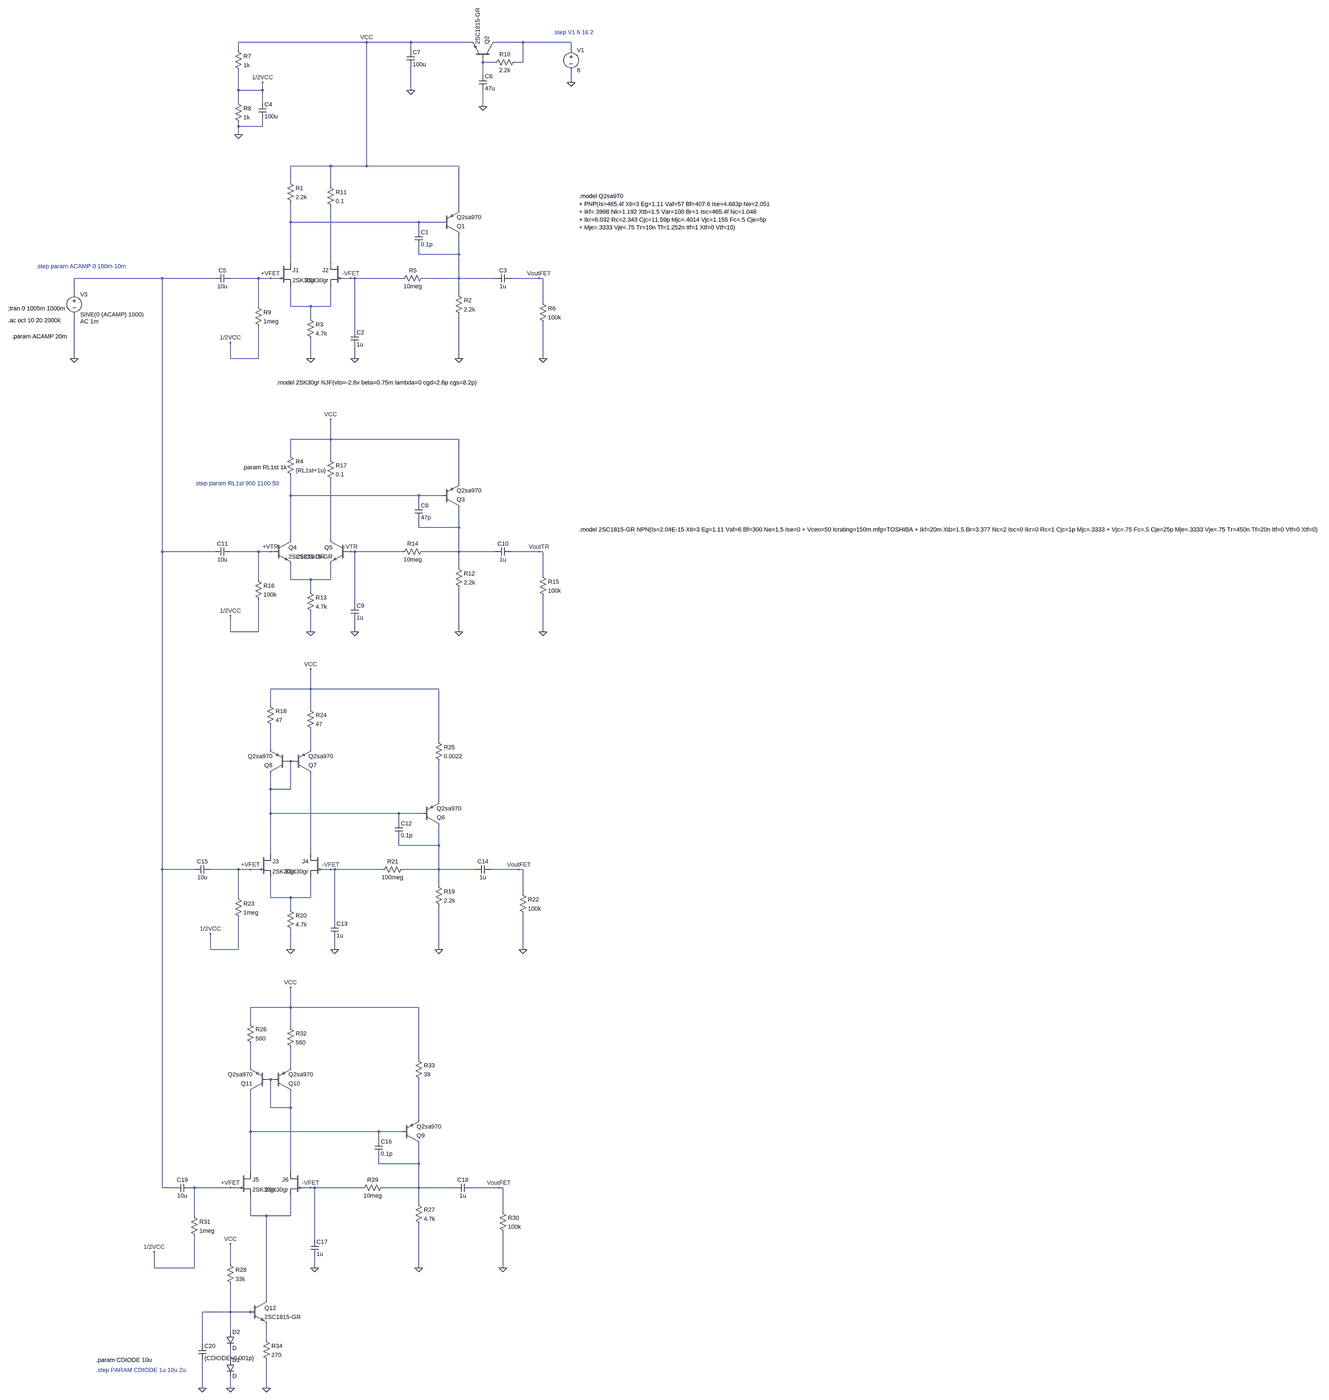
[diagram p0: schematic Discrete_OP 3stage.asc, whole sheet]
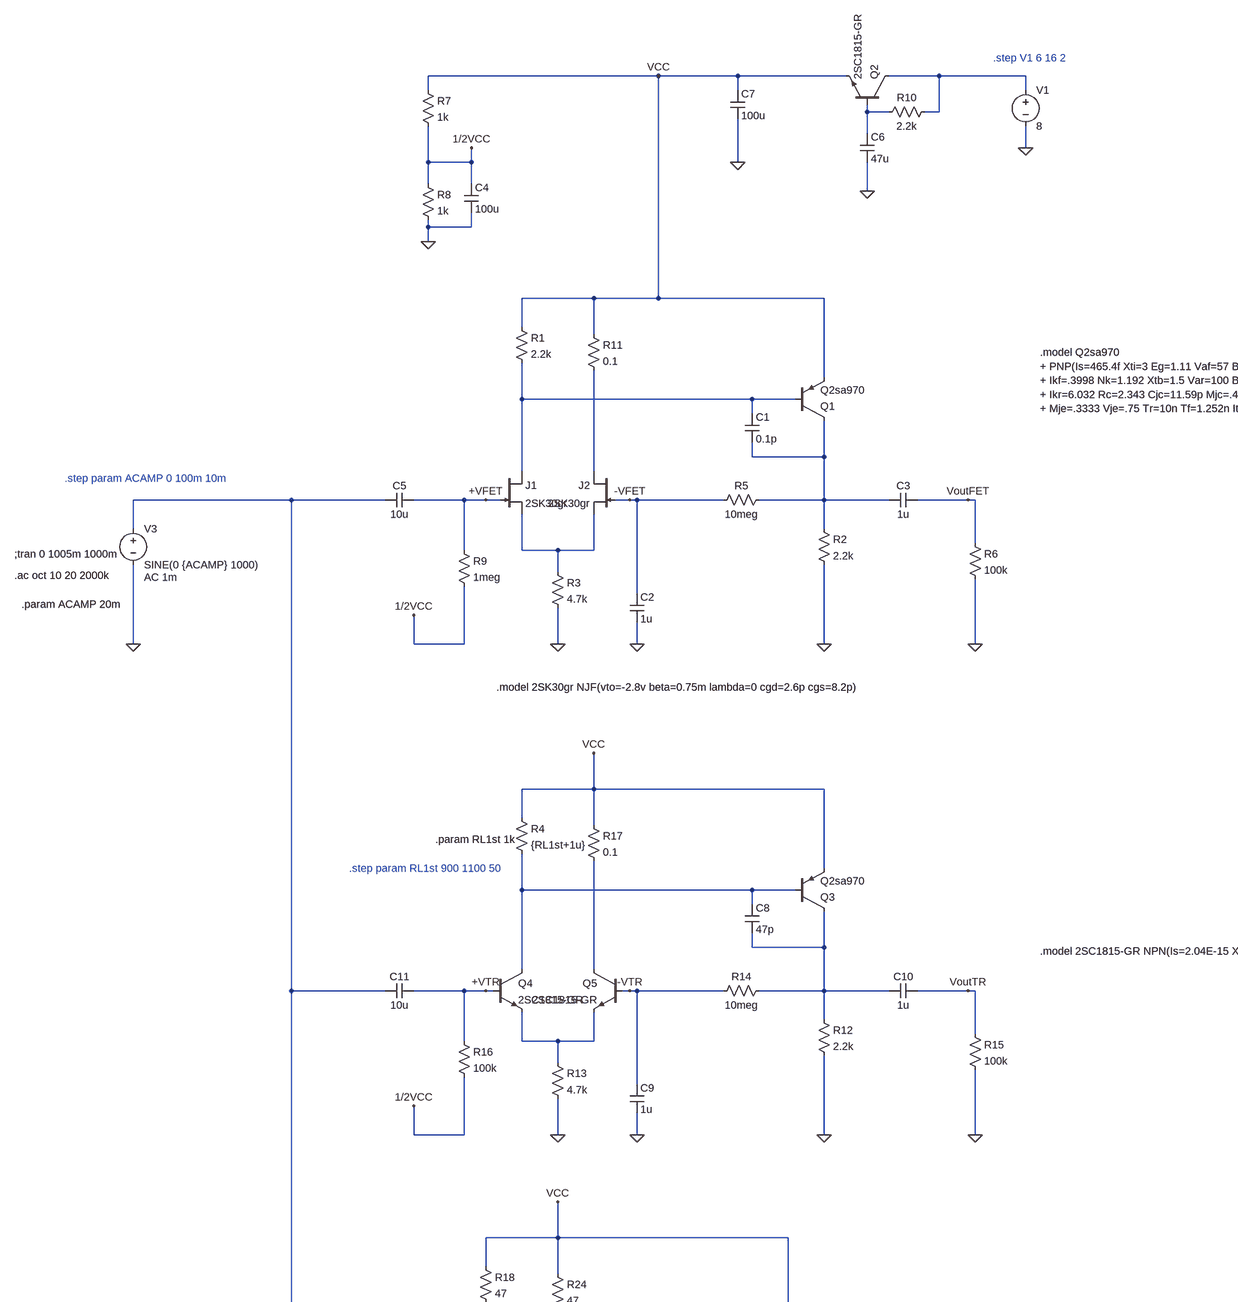
[diagram p1: schematic Discrete_OP 3stage.asc, part, row 1 of 2, column 1 of 2]
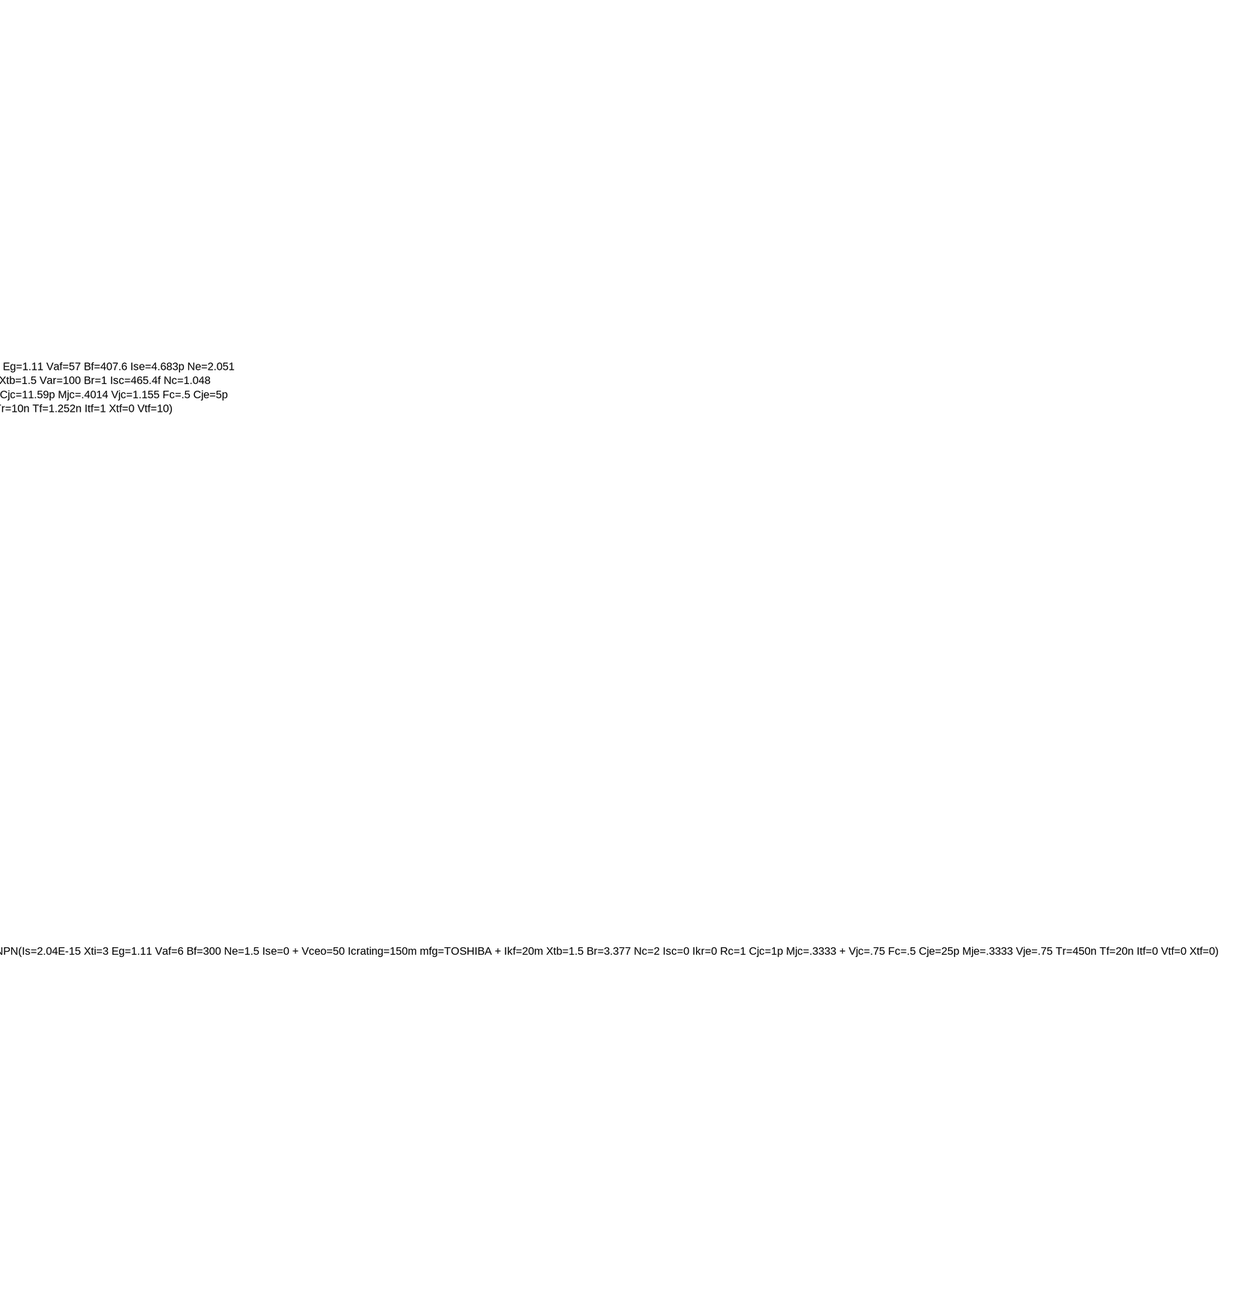
[diagram p2: schematic Discrete_OP 3stage.asc, part, row 1 of 2, column 2 of 2]
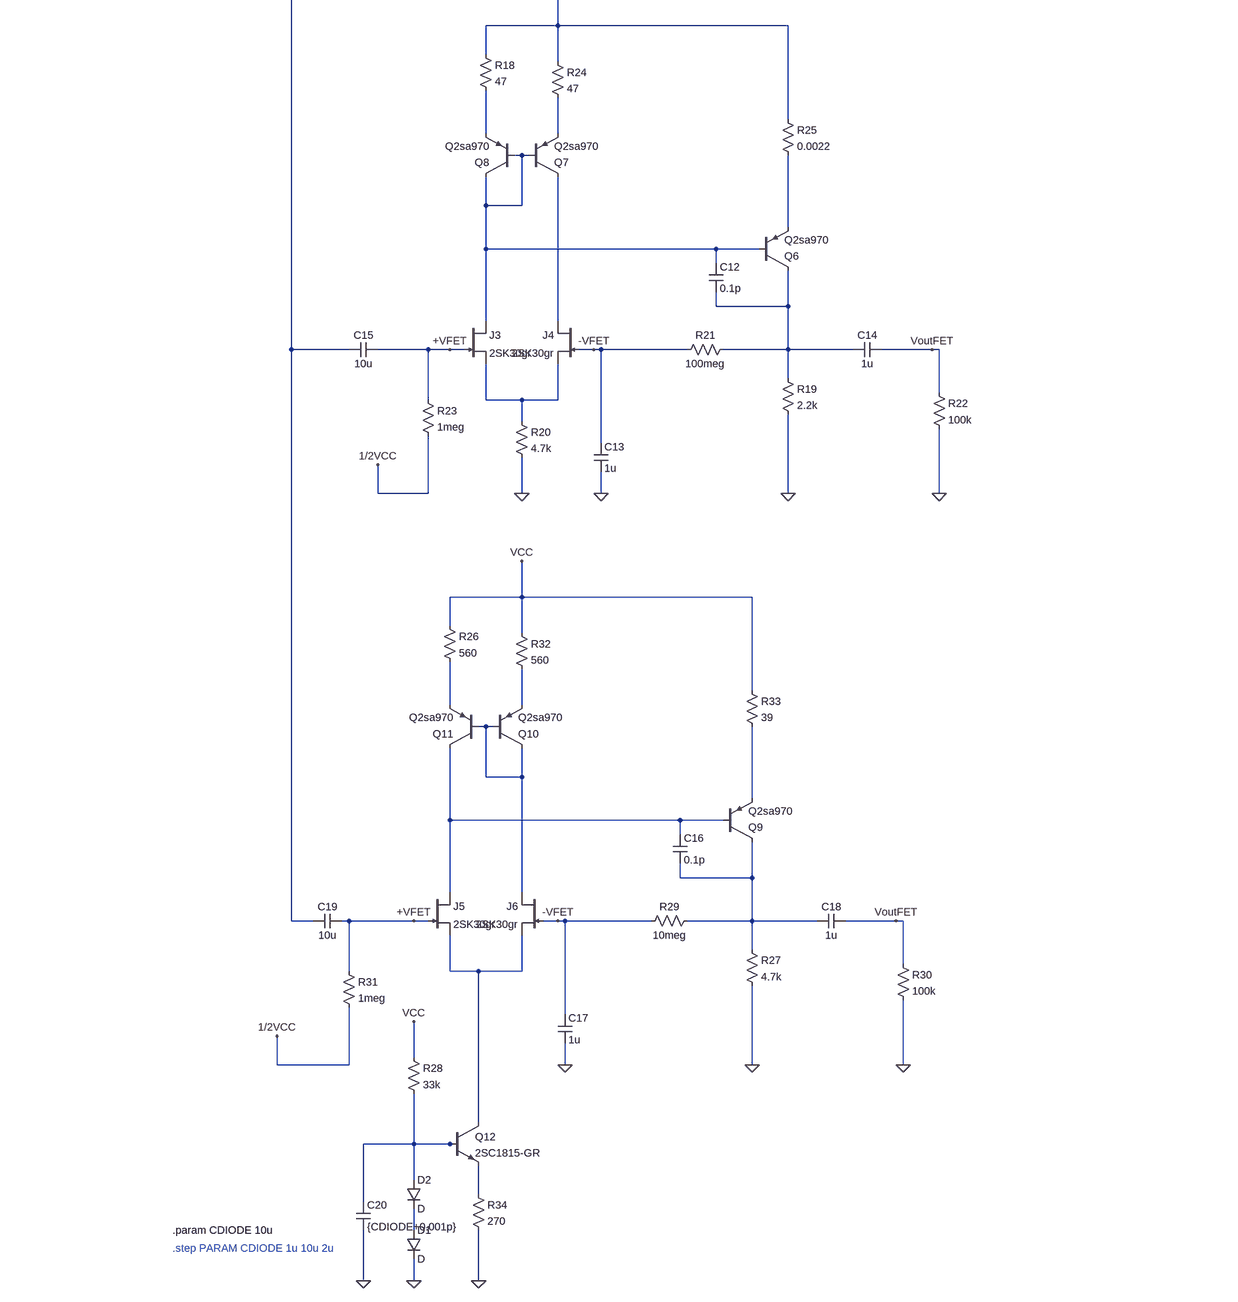
[diagram p3: schematic Discrete_OP 3stage.asc, part, row 2 of 2, column 1 of 2]
Discrete_OP 3stage.asc, the LTspice schematic file:
Version 4
SHEET 1 4864 4708
WIRE 608 -1136 96 -1136
WIRE 784 -1136 608 -1136
WIRE 1024 -1136 784 -1136
WIRE 1232 -1136 1120 -1136
WIRE 1424 -1136 1232 -1136
WIRE 96 -1104 96 -1136
WIRE 784 -1104 784 -1136
WIRE 1424 -1104 1424 -1136
WIRE 1072 -1056 1072 -1072
WIRE 1120 -1056 1072 -1056
WIRE 1232 -1056 1232 -1136
WIRE 1232 -1056 1200 -1056
WIRE 1072 -1008 1072 -1056
WIRE 1424 -976 1424 -1024
WIRE 96 -944 96 -1024
WIRE 192 -944 192 -976
WIRE 192 -944 96 -944
WIRE 784 -944 784 -1040
WIRE 96 -896 96 -944
WIRE 192 -896 192 -944
WIRE 1072 -880 1072 -944
WIRE 96 -800 96 -816
WIRE 192 -800 192 -832
WIRE 192 -800 96 -800
WIRE 96 -768 96 -800
WIRE 464 -560 304 -560
WIRE 608 -560 608 -1136
WIRE 608 -560 464 -560
WIRE 976 -560 608 -560
WIRE 304 -496 304 -560
WIRE 464 -480 464 -560
WIRE 976 -384 976 -560
WIRE 304 -336 304 -416
WIRE 816 -336 304 -336
WIRE 912 -336 816 -336
WIRE 816 -304 816 -336
WIRE 816 -208 816 -240
WIRE 976 -208 976 -288
WIRE 976 -208 816 -208
WIRE 304 -176 304 -336
WIRE 464 -176 464 -400
WIRE -208 -112 -560 -112
WIRE 0 -112 -208 -112
WIRE 176 -112 64 -112
WIRE 224 -112 176 -112
WIRE 256 -112 224 -112
WIRE 544 -112 512 -112
WIRE 560 -112 544 -112
WIRE 752 -112 560 -112
WIRE 976 -112 976 -208
WIRE 976 -112 832 -112
WIRE 1120 -112 976 -112
WIRE 1296 -112 1184 -112
WIRE 1312 -112 1296 -112
WIRE -560 -48 -560 -112
WIRE 976 -48 976 -112
WIRE 1312 -16 1312 -112
WIRE 176 0 176 -112
WIRE 304 0 304 -80
WIRE 384 0 304 0
WIRE 464 0 464 -80
WIRE 464 0 384 0
WIRE 384 48 384 0
WIRE 560 96 560 -112
WIRE -560 208 -560 32
WIRE 64 208 64 144
WIRE 176 208 176 80
WIRE 176 208 64 208
WIRE 384 208 384 128
WIRE 560 208 560 160
WIRE 976 208 976 32
WIRE 1312 208 1312 64
WIRE 464 544 464 464
WIRE 464 544 304 544
WIRE 976 544 464 544
WIRE 304 608 304 544
WIRE 464 624 464 544
WIRE 976 720 976 544
WIRE 304 768 304 688
WIRE 816 768 304 768
WIRE 912 768 816 768
WIRE 816 800 816 768
WIRE 816 896 816 864
WIRE 976 896 976 816
WIRE 976 896 816 896
WIRE 304 944 304 768
WIRE 464 944 464 704
WIRE -208 992 -208 -112
WIRE 0 992 -208 992
WIRE 176 992 64 992
WIRE 224 992 176 992
WIRE 240 992 224 992
WIRE 544 992 528 992
WIRE 560 992 544 992
WIRE 752 992 560 992
WIRE 976 992 976 896
WIRE 976 992 832 992
WIRE 1120 992 976 992
WIRE 1296 992 1184 992
WIRE 1312 992 1296 992
WIRE 976 1056 976 992
WIRE 1312 1088 1312 992
WIRE 176 1104 176 992
WIRE 304 1104 304 1040
WIRE 384 1104 304 1104
WIRE 464 1104 464 1040
WIRE 464 1104 384 1104
WIRE 384 1152 384 1104
WIRE 560 1200 560 992
WIRE 64 1312 64 1248
WIRE 176 1312 176 1184
WIRE 176 1312 64 1312
WIRE 384 1312 384 1232
WIRE 560 1312 560 1264
WIRE 976 1312 976 1136
WIRE 1312 1312 1312 1168
WIRE 384 1696 384 1616
WIRE 384 1696 224 1696
WIRE 896 1696 384 1696
WIRE 224 1760 224 1696
WIRE 384 1776 384 1696
WIRE 896 1904 896 1696
WIRE 224 1936 224 1840
WIRE 384 1936 384 1856
WIRE 304 1984 288 1984
WIRE 320 1984 304 1984
WIRE 224 2096 224 2032
WIRE 304 2096 304 1984
WIRE 304 2096 224 2096
WIRE 896 2144 896 1984
WIRE 224 2192 224 2096
WIRE 736 2192 224 2192
WIRE 832 2192 736 2192
WIRE 736 2224 736 2192
WIRE 736 2320 736 2288
WIRE 896 2320 896 2240
WIRE 896 2320 736 2320
WIRE 224 2352 224 2192
WIRE 384 2352 384 2032
WIRE -208 2416 -208 992
WIRE -80 2416 -208 2416
WIRE 96 2416 -16 2416
WIRE 144 2416 96 2416
WIRE 176 2416 144 2416
WIRE 464 2416 432 2416
WIRE 480 2416 464 2416
WIRE 672 2416 480 2416
WIRE 896 2416 896 2320
WIRE 896 2416 752 2416
WIRE 1040 2416 896 2416
WIRE 1216 2416 1104 2416
WIRE 1232 2416 1216 2416
WIRE 896 2480 896 2416
WIRE 1232 2512 1232 2416
WIRE 96 2528 96 2416
WIRE 224 2528 224 2448
WIRE 304 2528 224 2528
WIRE 384 2528 384 2448
WIRE 384 2528 304 2528
WIRE 304 2576 304 2528
WIRE 480 2624 480 2416
WIRE -16 2736 -16 2672
WIRE 96 2736 96 2608
WIRE 96 2736 -16 2736
WIRE 304 2736 304 2656
WIRE 480 2736 480 2688
WIRE 896 2736 896 2560
WIRE 1232 2736 1232 2592
WIRE 304 3168 304 3088
WIRE 304 3168 144 3168
WIRE 816 3168 304 3168
WIRE 144 3232 144 3168
WIRE 304 3248 304 3168
WIRE 816 3376 816 3168
WIRE 144 3408 144 3312
WIRE 304 3408 304 3328
WIRE 224 3456 208 3456
WIRE 240 3456 224 3456
WIRE 224 3568 224 3456
WIRE 304 3568 304 3504
WIRE 304 3568 224 3568
WIRE 816 3616 816 3456
WIRE 144 3664 144 3504
WIRE 656 3664 144 3664
WIRE 752 3664 656 3664
WIRE 656 3696 656 3664
WIRE 656 3792 656 3760
WIRE 816 3792 816 3712
WIRE 816 3792 656 3792
WIRE 144 3824 144 3664
WIRE 304 3824 304 3568
WIRE -208 3888 -208 2416
WIRE -160 3888 -208 3888
WIRE -80 3888 -96 3888
WIRE 64 3888 -80 3888
WIRE 96 3888 64 3888
WIRE 384 3888 352 3888
WIRE 400 3888 384 3888
WIRE 592 3888 400 3888
WIRE 816 3888 816 3792
WIRE 816 3888 672 3888
WIRE 960 3888 816 3888
WIRE 1136 3888 1024 3888
WIRE 1152 3888 1136 3888
WIRE 816 3952 816 3888
WIRE 1152 3984 1152 3888
WIRE -80 4000 -80 3888
WIRE 144 4000 144 3920
WIRE 208 4000 144 4000
WIRE 304 4000 304 3920
WIRE 304 4000 208 4000
WIRE 400 4096 400 3888
WIRE 64 4192 64 4112
WIRE -240 4208 -240 4144
WIRE -80 4208 -80 4080
WIRE -80 4208 -240 4208
WIRE 400 4208 400 4160
WIRE 816 4208 816 4032
WIRE 1152 4208 1152 4064
WIRE 208 4336 208 4000
WIRE 64 4384 64 4272
WIRE 64 4384 -48 4384
WIRE 144 4384 64 4384
WIRE 160 4384 144 4384
WIRE 64 4464 64 4384
WIRE 208 4496 208 4432
WIRE -48 4512 -48 4384
WIRE 64 4576 64 4528
WIRE -48 4688 -48 4576
WIRE 64 4688 64 4640
WIRE 208 4688 208 4576
FLAG -560 208 0
FLAG 384 208 0
FLAG 976 208 0
FLAG 1312 208 0
FLAG 1424 -976 0
FLAG 560 208 0
FLAG 1296 -112 VoutFET
FLAG 224 -112 +VFET
FLAG 544 -112 -VFET
FLAG 608 -1136 VCC
FLAG 96 -768 0
FLAG 192 -976 1/2VCC
FLAG 64 144 1/2VCC
FLAG 1072 -880 0
FLAG 784 -944 0
FLAG 384 1312 0
FLAG 976 1312 0
FLAG 1312 1312 0
FLAG 560 1312 0
FLAG 1296 992 VoutTR
FLAG 224 992 +VTR
FLAG 544 992 -VTR
FLAG 64 1248 1/2VCC
FLAG 464 464 VCC
FLAG 304 2736 0
FLAG 896 2736 0
FLAG 1232 2736 0
FLAG 480 2736 0
FLAG 1216 2416 VoutFET
FLAG 144 2416 +VFET
FLAG 464 2416 -VFET
FLAG -16 2672 1/2VCC
FLAG 384 1616 VCC
FLAG 208 4688 0
FLAG 816 4208 0
FLAG 1152 4208 0
FLAG 400 4208 0
FLAG 1136 3888 VoutFET
FLAG 64 3888 +VFET
FLAG 384 3888 -VFET
FLAG -240 4144 1/2VCC
FLAG 304 3088 VCC
FLAG 64 4688 0
FLAG 64 4112 VCC
FLAG -48 4688 0
SYMBOL njf 256 -176 R0
SYMATTR InstName J1
SYMATTR Value 2SK30gr
SYMBOL njf 512 -176 M0
SYMATTR InstName J2
SYMATTR Value 2SK30gr
SYMBOL pnp 912 -288 M180
SYMATTR InstName Q1
SYMATTR Value Q2sa970
SYMBOL res 288 -512 R0
SYMATTR InstName R1
SYMATTR Value 2.2k
SYMBOL res 960 -64 R0
SYMATTR InstName R2
SYMATTR Value 2.2k
SYMBOL cap 800 -304 R0
SYMATTR InstName C1
SYMATTR Value 0.1p
SYMBOL res 368 32 R0
SYMATTR InstName R3
SYMATTR Value 4.7k
SYMBOL voltage 1424 -1120 R0
WINDOW 123 0 0 Left 2
WINDOW 39 0 0 Left 2
SYMATTR InstName V1
SYMATTR Value 8
SYMBOL cap 544 96 R0
SYMATTR InstName C2
SYMATTR Value 1u
SYMBOL res 848 -128 R90
WINDOW 0 0 56 VBottom 2
WINDOW 3 32 56 VTop 2
SYMATTR InstName R5
SYMATTR Value 10meg
SYMBOL voltage -560 -64 R0
WINDOW 123 24 124 Left 2
WINDOW 39 0 0 Left 2
SYMATTR Value2 AC 1m
SYMATTR InstName V3
SYMATTR Value SINE(0 {ACAMP} 1000)
SYMBOL res 1296 -32 R0
SYMATTR InstName R6
SYMATTR Value 100k
SYMBOL cap 1184 -128 R90
WINDOW 0 0 32 VBottom 2
WINDOW 3 32 32 VTop 2
SYMATTR InstName C3
SYMATTR Value 1u
SYMBOL res 80 -1120 R0
SYMATTR InstName R7
SYMATTR Value 1k
SYMBOL res 80 -912 R0
SYMATTR InstName R8
SYMATTR Value 1k
SYMBOL cap 176 -896 R0
SYMATTR InstName C4
SYMATTR Value 100u
SYMBOL res 160 -16 R0
SYMATTR InstName R9
SYMATTR Value 1meg
SYMBOL cap 64 -128 R90
WINDOW 0 0 32 VBottom 2
WINDOW 3 32 32 VTop 2
SYMATTR InstName C5
SYMATTR Value 10u
SYMBOL npn 1120 -1072 M270
SYMATTR InstName Q2
SYMATTR Value 2SC1815-GR
SYMBOL res 1216 -1072 R90
WINDOW 0 0 56 VBottom 2
WINDOW 3 32 56 VTop 2
SYMATTR InstName R10
SYMATTR Value 2.2k
SYMBOL cap 1056 -1008 R0
SYMATTR InstName C6
SYMATTR Value 47u
SYMBOL cap 768 -1104 R0
SYMATTR InstName C7
SYMATTR Value 100u
SYMBOL res 448 -496 R0
SYMATTR InstName R11
SYMATTR Value 0.1
SYMBOL pnp 912 816 M180
SYMATTR InstName Q3
SYMATTR Value Q2sa970
SYMBOL res 288 592 R0
SYMATTR InstName R4
SYMATTR Value {RL1st+1u}
SYMBOL res 960 1040 R0
SYMATTR InstName R12
SYMATTR Value 2.2k
SYMBOL cap 800 800 R0
SYMATTR InstName C8
SYMATTR Value 47p
SYMBOL res 368 1136 R0
SYMATTR InstName R13
SYMATTR Value 4.7k
SYMBOL cap 544 1200 R0
SYMATTR InstName C9
SYMATTR Value 1u
SYMBOL res 848 976 R90
WINDOW 0 0 56 VBottom 2
WINDOW 3 32 56 VTop 2
SYMATTR InstName R14
SYMATTR Value 10meg
SYMBOL res 1296 1072 R0
SYMATTR InstName R15
SYMATTR Value 100k
SYMBOL cap 1184 976 R90
WINDOW 0 0 32 VBottom 2
WINDOW 3 32 32 VTop 2
SYMATTR InstName C10
SYMATTR Value 1u
SYMBOL res 160 1088 R0
SYMATTR InstName R16
SYMATTR Value 100k
SYMBOL cap 64 976 R90
WINDOW 0 0 32 VBottom 2
WINDOW 3 32 32 VTop 2
SYMATTR InstName C11
SYMATTR Value 10u
SYMBOL res 448 608 R0
SYMATTR InstName R17
SYMATTR Value 0.1
SYMBOL npn 240 944 R0
SYMATTR InstName Q4
SYMATTR Value 2SC1815-GR
SYMBOL npn 528 944 M0
SYMATTR InstName Q5
SYMATTR Value 2SC1815-GR
SYMBOL njf 176 2352 R0
SYMATTR InstName J3
SYMATTR Value 2SK30gr
SYMBOL njf 432 2352 M0
SYMATTR InstName J4
SYMATTR Value 2SK30gr
SYMBOL pnp 832 2240 M180
SYMATTR InstName Q6
SYMATTR Value Q2sa970
SYMBOL res 208 1744 R0
SYMATTR InstName R18
SYMATTR Value 47
SYMBOL res 880 2464 R0
SYMATTR InstName R19
SYMATTR Value 2.2k
SYMBOL cap 720 2224 R0
SYMATTR InstName C12
SYMATTR Value 0.1p
SYMBOL res 288 2560 R0
SYMATTR InstName R20
SYMATTR Value 4.7k
SYMBOL cap 464 2624 R0
SYMATTR InstName C13
SYMATTR Value 1u
SYMBOL res 768 2400 R90
WINDOW 0 0 56 VBottom 2
WINDOW 3 32 56 VTop 2
SYMATTR InstName R21
SYMATTR Value 100meg
SYMBOL res 1216 2496 R0
SYMATTR InstName R22
SYMATTR Value 100k
SYMBOL cap 1104 2400 R90
WINDOW 0 0 32 VBottom 2
WINDOW 3 32 32 VTop 2
SYMATTR InstName C14
SYMATTR Value 1u
SYMBOL res 80 2512 R0
SYMATTR InstName R23
SYMATTR Value 1meg
SYMBOL cap -16 2400 R90
WINDOW 0 0 32 VBottom 2
WINDOW 3 32 32 VTop 2
SYMATTR InstName C15
SYMATTR Value 10u
SYMBOL res 368 1760 R0
SYMATTR InstName R24
SYMATTR Value 47
SYMBOL pnp 320 2032 M180
SYMATTR InstName Q7
SYMATTR Value Q2sa970
SYMBOL pnp 288 2032 R180
SYMATTR InstName Q8
SYMATTR Value Q2sa970
SYMBOL res 880 1888 R0
SYMATTR InstName R25
SYMATTR Value 0.0022
SYMBOL njf 96 3824 R0
SYMATTR InstName J5
SYMATTR Value 2SK30gr
SYMBOL njf 352 3824 M0
SYMATTR InstName J6
SYMATTR Value 2SK30gr
SYMBOL pnp 752 3712 M180
SYMATTR InstName Q9
SYMATTR Value Q2sa970
SYMBOL res 128 3216 R0
SYMATTR InstName R26
SYMATTR Value 560
SYMBOL res 800 3936 R0
SYMATTR InstName R27
SYMATTR Value 4.7k
SYMBOL cap 640 3696 R0
SYMATTR InstName C16
SYMATTR Value 0.1p
SYMBOL cap 384 4096 R0
SYMATTR InstName C17
SYMATTR Value 1u
SYMBOL res 688 3872 R90
WINDOW 0 0 56 VBottom 2
WINDOW 3 32 56 VTop 2
SYMATTR InstName R29
SYMATTR Value 10meg
SYMBOL res 1136 3968 R0
SYMATTR InstName R30
SYMATTR Value 100k
SYMBOL cap 1024 3872 R90
WINDOW 0 0 32 VBottom 2
WINDOW 3 32 32 VTop 2
SYMATTR InstName C18
SYMATTR Value 1u
SYMBOL res -96 3984 R0
SYMATTR InstName R31
SYMATTR Value 1meg
SYMBOL cap -96 3872 R90
WINDOW 0 0 32 VBottom 2
WINDOW 3 32 32 VTop 2
SYMATTR InstName C19
SYMATTR Value 10u
SYMBOL res 288 3232 R0
SYMATTR InstName R32
SYMATTR Value 560
SYMBOL pnp 240 3504 M180
SYMATTR InstName Q10
SYMATTR Value Q2sa970
SYMBOL pnp 208 3504 R180
SYMATTR InstName Q11
SYMATTR Value Q2sa970
SYMBOL res 800 3360 R0
SYMATTR InstName R33
SYMATTR Value 39
SYMBOL diode 48 4576 R0
SYMATTR InstName D1
SYMBOL diode 48 4464 R0
SYMATTR InstName D2
SYMBOL npn 144 4336 R0
SYMATTR InstName Q12
SYMATTR Value 2SC1815-GR
SYMBOL res 48 4176 R0
SYMATTR InstName R28
SYMATTR Value 33k
SYMBOL res 192 4480 R0
SYMATTR InstName R34
SYMATTR Value 270
SYMBOL cap -64 4512 R0
SYMATTR InstName C20
SYMATTR Value {CDIODE+0.001p}
TEXT 1456 -440 Left 2 !.model Q2sa970 \n+ PNP(Is=465.4f Xti=3 Eg=1.11 Vaf=57 Bf=407.6 Ise=4.683p Ne=2.051\n+ Ikf=.3998 Nk=1.192 Xtb=1.5 Var=100 Br=1 Isc=465.4f Nc=1.048\n+ Ikr=6.032 Rc=2.343 Cjc=11.59p Mjc=.4014 Vjc=1.155 Fc=.5 Cje=5p\n+ Mje=.3333 Vje=.75 Tr=10n Tf=1.252n Itf=1 Xtf=0 Vtf=10)
TEXT -824 8 Left 2 !;tran 0 1005m 1000m
TEXT 248 304 Left 2 !.model 2SK30gr NJF(vto=-2.8v beta=0.75m lambda=0 cgd=2.6p cgs=8.2p)
TEXT 1352 -1176 Left 2 ;.step V1 6 16 2
TEXT -824 56 Left 2 !.ac oct 10 20 2000k
TEXT -808 120 Left 2 !.param ACAMP 20m
TEXT -712 -160 Left 2 ;.step param ACAMP 0 100m 10m
TEXT 1456 904 Left 2 !.model 2SC1815-GR NPN(Is=2.04E-15 Xti=3 Eg=1.11 Vaf=6 Bf=300 Ne=1.5 Ise=0 + Vceo=50 Icrating=150m mfg=TOSHIBA + Ikf=20m Xtb=1.5 Br=3.377 Nc=2 Isc=0 Ikr=0 Rc=1 Cjc=1p Mjc=.3333 + Vjc=.75 Fc=.5 Cje=25p Mje=.3333 Vje=.75 Tr=450n Tf=20n Itf=0 Vtf=0 Xtf=0)
TEXT 112 656 Left 2 !.param RL1st 1k
TEXT -80 720 Left 2 ;.step param RL1st 900 1100 50
TEXT -472 4616 Left 2 ;.step PARAM CDIODE 1u 10u 2u
TEXT -472 4576 Left 2 !.param CDIODE 10u

The netlist it stands for:
* Discrete_OP 3stage.asc
J1 N003 +VFET N007 2SK30gr
J2 N005 -VFET N007 2SK30gr
Q1 N004 N003 VCC 0 Q2sa970
R1 VCC N003 2.2k
R2 N004 0 2.2k
C1 N003 N004 0.1p
R3 N007 0 4.7k
V1 N001 0 8
C2 -VFET 0 1u
R5 N004 -VFET 10meg
V3 N006 0 SINE(0 {ACAMP} 1000) AC 1m
R6 VoutFET 0 100k
C3 VoutFET N004 1u
R7 VCC 1/2VCC 1k
R8 1/2VCC 0 1k
C4 1/2VCC 0 100u
R9 +VFET 1/2VCC 1meg
C5 +VFET N006 10u
Q2 N001 N002 VCC 0 2SC1815-GR
R10 N001 N002 2.2k
C6 N002 0 47u
C7 VCC 0 100u
R11 VCC N005 0.1
Q3 N009 N008 VCC 0 Q2sa970
R4 VCC N008 {RL1st+1u}
R12 N009 0 2.2k
C8 N008 N009 47p
R13 N011 0 4.7k
C9 -VTR 0 1u
R14 N009 -VTR 10meg
R15 VoutTR 0 100k
C10 VoutTR N009 1u
R16 +VTR 1/2VCC 100k
C11 +VTR N006 10u
R17 VCC N010 0.1
Q4 N008 +VTR N011 0 2SC1815-GR
Q5 N010 -VTR N011 0 2SC1815-GR
J3 N014 +VFET N018 2SK30gr
J4 N017 -VFET N018 2SK30gr
Q6 N016 N014 N015 0 Q2sa970
R18 VCC N012 47
R19 N016 0 2.2k
C12 N014 N016 0.1p
R20 N018 0 4.7k
C13 -VFET 0 1u
R21 N016 -VFET 100meg
R22 VoutFET 0 100k
C14 VoutFET N016 1u
R23 +VFET 1/2VCC 1meg
C15 +VFET N006 10u
R24 VCC N013 47
Q7 N017 N014 N013 0 Q2sa970
Q8 N014 N014 N012 0 Q2sa970
R25 VCC N015 0.0022
J5 N023 +VFET N025 2SK30gr
J6 N021 -VFET N025 2SK30gr
Q9 N024 N023 N022 0 Q2sa970
R26 VCC N019 560
R27 N024 0 4.7k
C16 N023 N024 0.1p
C17 -VFET 0 1u
R29 N024 -VFET 10meg
R30 VoutFET 0 100k
C18 VoutFET N024 1u
R31 +VFET 1/2VCC 1meg
C19 +VFET N006 10u
R32 VCC N020 560
Q10 N021 N021 N020 0 Q2sa970
Q11 N023 N021 N019 0 Q2sa970
R33 VCC N022 39
D1 N028 0 D
D2 N026 N028 D
Q12 N025 N026 N027 0 2SC1815-GR
R28 VCC N026 33k
R34 N027 0 270
C20 N026 0 {CDIODE+0.001p}
.model D D
.lib standard.dio
.model NPN NPN
.model PNP PNP
.lib standard.bjt
.model NJF NJF
.model PJF PJF
.lib standard.jft
.model Q2sa970
+ PNP(Is=465.4f Xti=3 Eg=1.11 Vaf=57 Bf=407.6 Ise=4.683p Ne=2.051
+ Ikf=.3998 Nk=1.192 Xtb=1.5 Var=100 Br=1 Isc=465.4f Nc=1.048
+ Ikr=6.032 Rc=2.343 Cjc=11.59p Mjc=.4014 Vjc=1.155 Fc=.5 Cje=5p
+ Mje=.3333 Vje=.75 Tr=10n Tf=1.252n Itf=1 Xtf=0 Vtf=10)
;tran 0 1005m 1000m
.model 2SK30gr NJF(vto=-2.8v beta=0.75m lambda=0 cgd=2.6p cgs=8.2p)
* .step V1 6 16 2
.ac oct 10 20 2000k
.param ACAMP 20m
* .step param ACAMP 0 100m 10m
.model 2SC1815-GR NPN(Is=2.04E-15 Xti=3 Eg=1.11 Vaf=6 Bf=300 Ne=1.5 Ise=0 + Vceo=50 Icrating=150m mfg=TOSHIBA + Ikf=20m Xtb=1.5 Br=3.377 Nc=2 Isc=0 Ikr=0 Rc=1 Cjc=1p Mjc=.3333 + Vjc=.75 Fc=.5 Cje=25p Mje=.3333 Vje=.75 Tr=450n Tf=20n Itf=0 Vtf=0 Xtf=0)
.param RL1st 1k
* .step param RL1st 900 1100 50
* .step PARAM CDIODE 1u 10u 2u
.param CDIODE 10u
.backanno
.end